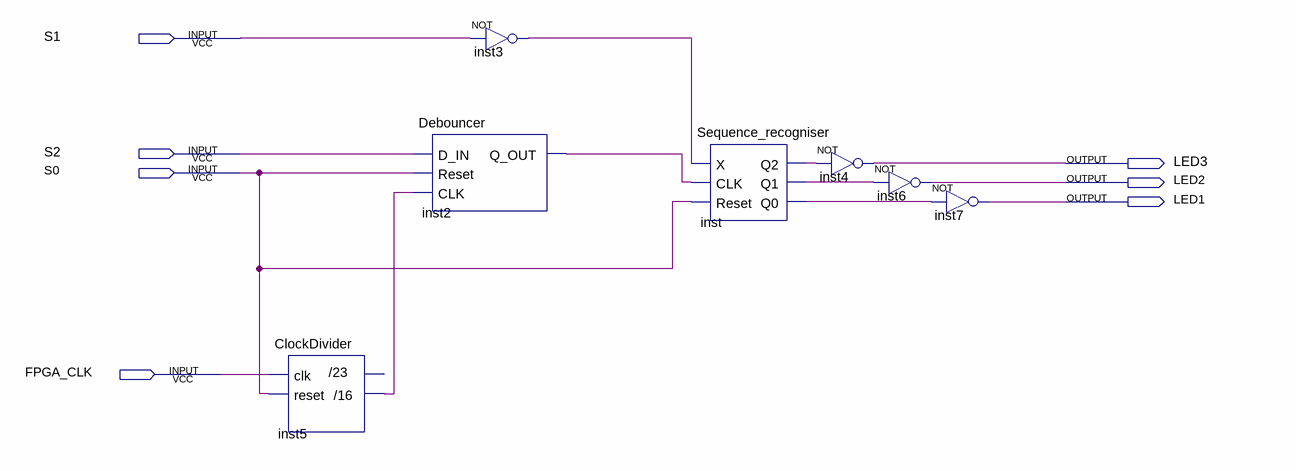
[diagram p0: schematic sheet]
// Quartus schematic TEST.bdf as structural Verilog: 7 symbols, 7 pins
module TEST (
  input  S1,
  input  S2,
  input  S0,
  input  FPGA_CLK,
  output LED3,
  output LED2,
  output LED1
);

  wire inst2_q_out, inst3_out, inst5__16, inst_q0, inst_q1, inst_q2;

  ClockDivider inst5 (.clk(FPGA_CLK), .reset(S0), .\/16 (inst5__16));  // open: /23
  Debouncer inst2 (.D_IN(S2), .Reset(S0), .CLK(inst5__16), .Q_OUT(inst2_q_out));
  not inst3 (inst3_out, S1);
  Sequence_recogniser inst (.X(inst3_out), .CLK(inst2_q_out), .Reset(S0), .Q2(inst_q2), .Q1(inst_q1), .Q0(inst_q0));
  not inst4 (LED3, inst_q2);
  not inst6 (LED2, inst_q1);
  not inst7 (LED1, inst_q0);
endmodule
